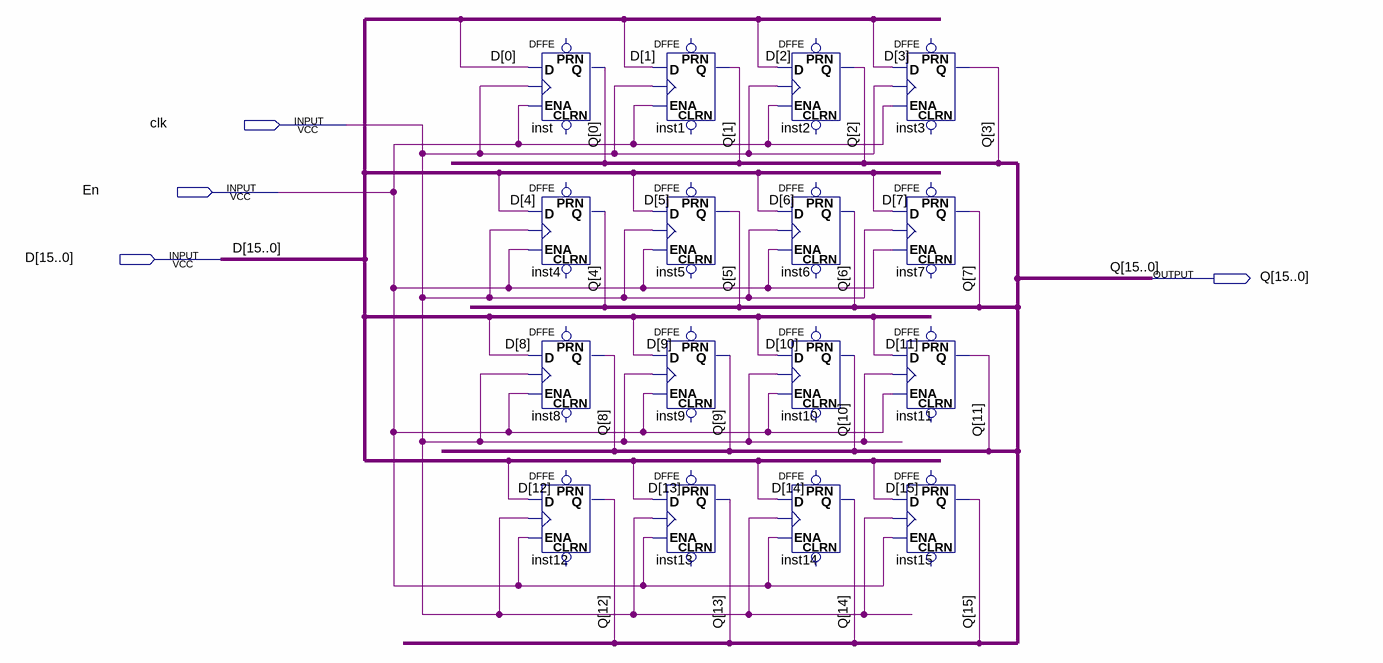
[diagram p0: schematic sheet]
// Quartus schematic 16_Register.bdf as structural Verilog: 16 symbols, 4 pins
module \16_Register  (
  input  clk,
  input  En,
  input  [15:0] D,
  output [15:0] Q
);

  DFFE inst (.D(D[0]), .CLK(clk), .ENA(En), .Q(Q[0]));  // open: PRN, CLRN
  DFFE inst4 (.D(D[4]), .CLK(clk), .ENA(En), .Q(Q[4]));  // open: PRN, CLRN
  DFFE inst8 (.D(D[8]), .CLK(clk), .ENA(En), .Q(Q[8]));  // open: PRN, CLRN
  DFFE inst12 (.D(D[12]), .CLK(clk), .ENA(En), .Q(Q[12]));  // open: PRN, CLRN
  DFFE inst1 (.D(D[1]), .CLK(clk), .ENA(En), .Q(Q[1]));  // open: PRN, CLRN
  DFFE inst5 (.D(D[5]), .CLK(clk), .ENA(En), .Q(Q[5]));  // open: PRN, CLRN
  DFFE inst9 (.D(D[9]), .CLK(clk), .ENA(En), .Q(Q[9]));  // open: PRN, CLRN
  DFFE inst13 (.D(D[13]), .CLK(clk), .ENA(En), .Q(Q[13]));  // open: PRN, CLRN
  DFFE inst2 (.D(D[2]), .CLK(clk), .ENA(En), .Q(Q[2]));  // open: PRN, CLRN
  DFFE inst6 (.D(D[6]), .CLK(clk), .ENA(En), .Q(Q[6]));  // open: PRN, CLRN
  DFFE inst10 (.D(D[10]), .CLK(clk), .ENA(En), .Q(Q[10]));  // open: PRN, CLRN
  DFFE inst14 (.D(D[14]), .CLK(clk), .ENA(En), .Q(Q[14]));  // open: PRN, CLRN
  DFFE inst3 (.D(D[3]), .CLK(clk), .ENA(En), .Q(Q[3]));  // open: PRN, CLRN
  DFFE inst7 (.D(D[7]), .CLK(clk), .ENA(En), .Q(Q[7]));  // open: PRN, CLRN
  DFFE inst11 (.D(D[11]), .CLK(clk), .ENA(En), .Q(Q[11]));  // open: PRN, CLRN
  DFFE inst15 (.D(D[15]), .CLK(clk), .ENA(En), .Q(Q[15]));  // open: PRN, CLRN
endmodule
